# Altium project Digital_Menu.PrjPcb
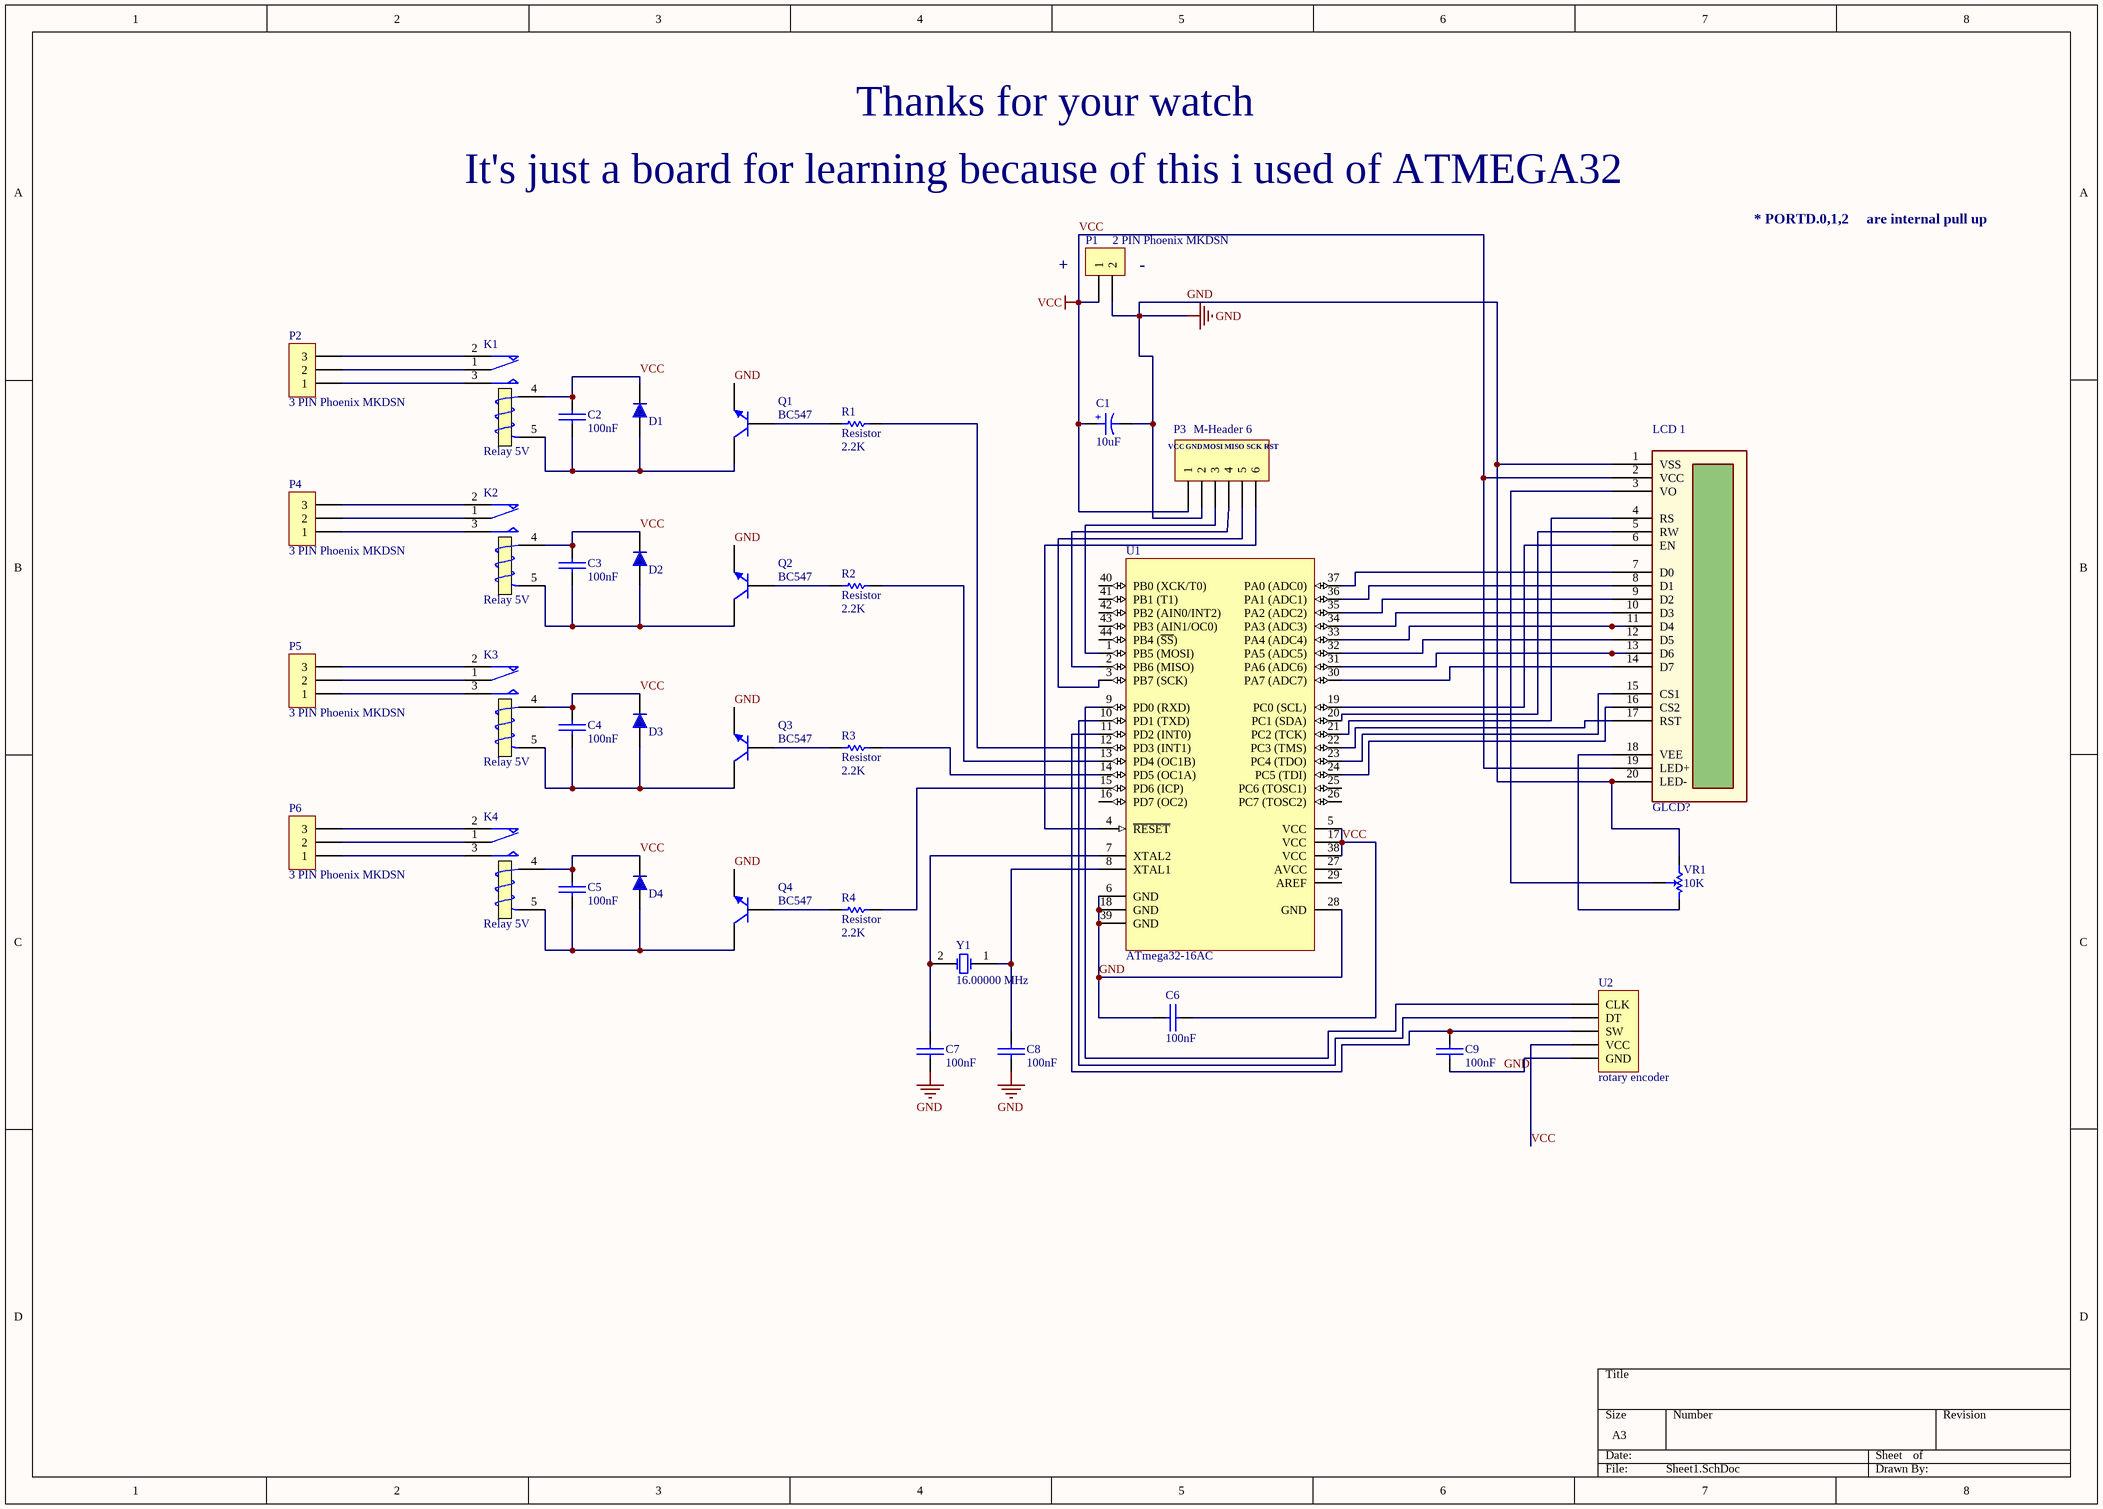
[diagram p0: Sheet1.SchDoc]
1 sheet, 36 parts. Net scope: global (net labels, ports and power ports of the same name join across sheets).
Board file: PCB1.PcbDoc

## Sheet Sheet1.SchDoc
size A3; SheetNumber: 1; SheetTotal: 1

### Parts
C1  10uF  [Cap 12.5x25-5]
C2  100nF  [Cap - 100nF]
C3  100nF  [Cap - 100nF]
C4  100nF  [Cap - 100nF]
C5  100nF  [Cap - 100nF]
C6  100nF  [Cap - 100nF]
C7  100nF  [Cap - 100nF]
C8  100nF  [Cap - 100nF]
C9  100nF  [Cap - 100nF]
D1  1n4007  [Diode 1N4007 SMD]  (value not drawn)
D2  1n4007  [Diode 1N4007 SMD]  (value not drawn)
D3  1n4007  [Diode 1N4007 SMD]  (value not drawn)
D4  1n4007  [Diode 1N4007 SMD]  (value not drawn)
K1  Relay 5V  [Relay 15.40x12.10x13.10]
K2  Relay 5V  [Relay 15.40x12.10x13.10]
K3  Relay 5V  [Relay 15.40x12.10x13.10]
K4  Relay 5V  [Relay 15.40x12.10x13.10]
LCD_1  GLCD?  [LCD 128x64 graphic]
P1  2 PIN Phoenix MKDSN  [2 PIN Phoenix MKDSN]
P2  3 PIN Phoenix MKDSN  [3 PIN Phoenix MKDSN]
P3  M-Header 6  [M-Header 6]
P4  3 PIN Phoenix MKDSN  [3 PIN Phoenix MKDSN]
P5  3 PIN Phoenix MKDSN  [3 PIN Phoenix MKDSN]
P6  3 PIN Phoenix MKDSN  [3 PIN Phoenix MKDSN]
Q1  BC547  [BC547 SMD SOT-23]
Q2  BC547  [BC547 SMD SOT-23]
Q3  BC547  [BC547 SMD SOT-23]
Q4  BC547  [BC547 SMD SOT-23]
R1  Resistor  value 2.2K  [Resistor_SMD_1206 (3216)]
R2  Resistor  value 2.2K  [Resistor_SMD_1206 (3216)]
R3  Resistor  value 2.2K  [Resistor_SMD_1206 (3216)]
R4  Resistor  value 2.2K  [Resistor_SMD_1206 (3216)]
U1  ATmega32-16AC  [44A]
U2  rotary encoder  [rotary encoder]
VR1  value 10K  [Multi Turn]  (hidden comment: Multi Turn)
Y1  16.00000 MHz  [XTAL Small]

### Nets
GND: C1.2 C6.1(+) C7.2(-) C8.2(-) C9.2(-) LCD_1.1(VSS) LCD_1.20(LED-) P1.2 P3.2 Q1.1(E) Q2.1(E) Q3.1(E) Q4.1(E) U1.6(GND) U1.18(GND) U1.28(GND) U1.39(GND) U2.5(GND) VR1.1(CCW)
VCC: C1.1 C2.2(-) C3.2(-) C4.2(-) C5.2(-) C6.2(-) D1.2 D2.2 D3.2 D4.2 K1.4(T1) K2.4(T1) K3.4(T1) K4.4(T1) LCD_1.2(VCC) LCD_1.19(LED+) P1.1 P3.1 U1.5(VCC) U1.17(VCC) U1.38(VCC) U2.4(VCC)
NetC2_1: C2.1(+) D1.1 K1.5(T2) Q1.3(C)
NetC3_1: C3.1(+) D2.1 K2.5(T2) Q2.3(C)
NetC4_1: C4.1(+) D3.1 K3.5(T2) Q3.3(C)
NetC5_1: C5.1(+) D4.1 K4.5(T2) Q4.3(C)
NetC7_1: C7.1(+) U1.7(XTAL2) Y1.2(OSC2)
NetC8_1: C8.1(+) U1.8(XTAL1) Y1.1(OSC1)
NetC9_1: C9.1(+) U1.11(PD2_(INT0)) U2.3(SW)
NetK1_1: K1.1(COM) P2.2
NetK1_2: K1.2(NC) P2.3
NetK1_3: K1.3(NO) P2.1
NetK2_1: K2.1(COM) P4.2
NetK2_2: K2.2(NC) P4.3
NetK2_3: K2.3(NO) P4.1
NetK3_1: K3.1(COM) P5.2
NetK3_2: K3.2(NC) P5.3
NetK3_3: K3.3(NO) P5.1
NetK4_1: K4.1(COM) P6.2
NetK4_2: K4.2(NC) P6.3
NetK4_3: K4.3(NO) P6.1
NetLCD_1_3: LCD_1.3(VO) VR1.3(Setpoint)
NetLCD_1_4: LCD_1.4(RS) U1.21(PC2_(TCK))
NetLCD_1_5: LCD_1.5(RW) U1.20(PC1_(SDA))
NetLCD_1_6: LCD_1.6(EN) U1.19(PC0_(SCL))
NetLCD_1_7: LCD_1.7(D0) U1.37(PA0_(ADC0))
NetLCD_1_8: LCD_1.8(D1) U1.36(PA1_(ADC1))
NetLCD_1_9: LCD_1.9(D2) U1.35(PA2_(ADC2))
NetLCD_1_10: LCD_1.10(D3) U1.34(PA3_(ADC3))
NetLCD_1_11: LCD_1.11(D4) U1.33(PA4_(ADC4))
NetLCD_1_12: LCD_1.12(D5) U1.32(PA5_(ADC5))
NetLCD_1_13: LCD_1.13(D6) U1.31(PA6_(ADC6))
NetLCD_1_14: LCD_1.14(D7) U1.30(PA7_(ADC7))
NetLCD_1_15: LCD_1.15(CS1) U1.23(PC4_(TDO))
NetLCD_1_16: LCD_1.16(CS2) U1.24(PC5_(TDI))
NetLCD_1_17: LCD_1.17(RST) U1.22(PC3_(TMS))
NetLCD_1_18: LCD_1.18(VEE) VR1.2(CW)
NetP3_3: P3.3 U1.1(PB5_(MOSI))
NetP3_4: P3.4 U1.2(PB6_(MISO))
NetP3_5: P3.5 U1.3(PB7_(SCK))
NetP3_6: P3.6 U1.4(~{RESET})
NetQ1_2: Q1.2(B) R1.1
NetQ2_2: Q2.2(B) R2.1
NetQ3_2: Q3.2(B) R3.1
NetQ4_2: Q4.2(B) R4.1
NetR1_2: R1.2 U1.12(PD3_(INT1))
NetR2_2: R2.2 U1.13(PD4_(OC1B))
NetR3_2: R3.2 U1.14(PD5_(OC1A))
NetR4_2: R4.2 U1.15(PD6_(ICP))
NetU1_9: U1.9(PD0_(RXD)) U2.1(CLK)
NetU1_10: U1.10(PD1_(TXD)) U2.2(DT)

Not connected (* = marked no-connect by the designer): U1 16(PD7_(OC2)) 25(PC6_(TOSC1)) 26(PC7_(TOSC2)) 27(AVCC) 29(AREF) 40(PB0_(XCK/T0)) 41(PB1_(T1)) 42(PB2_(AIN0/INT2)) 43(PB3_(AIN1/OC0)) 44(PB4_(~{SS}))

### Notes on the sheet
- Thanks for your watch
- It's just a board for learning because of this i used of ATMEGA32
- * PORTD.0,1,2     are internal pull up
- (near P1) +
- (near P1) -
- (near P3) VCC
- (near P3) GND
- (near P3) MOSI
- (near P3) MISO
- (near P3) SCK
- (near P3) RST
- (in symbol Capacitor DIP) +

### Library data of the parts
C1 = Capacitor DIP
C2-C9 = Cap-Bipolar: Bipolar Capacitor; Voltage: 100V; Designer: Saeid Jorablo; Organazation: ControTec; Adding Date: 1387/12/20; Value: 100nF
D1-D4 = Diode 1n4007
K1-K4 = Relay 15.40x12.10x13.10
LCD_1 = LCD 128x64 graphic
R1-R4 = Resistor: Email: razi.vesali@gmail.com; Published: 17-Jun-2016; LatestRevisionNote: Re-released for puplic; Publisher: Seyed Razi Vesali
U1 = ATmega32-16AC: 8-Bit AVR Microcontroller with 32K Bytes of In-System Programmable Flash Memory; Package Information: Latest Revision: 1995; Published: 17-Sep-2003; Revision: 17-Dec-2003: PCB Footprint updated; Datasheet: Latest Revision: 2503C-AVR-10/02; Package Reference: 44A; Publisher: Altium Limited
VR1 = Multi Turn: Email: Razi.vesali@gmail.com; LatestRevisionDate: 17-Jul-2016; LatestRevisionNote: Re-released for Puplic; Publisher: Seyed Razi vesali (SRV)
Y1 = XTAL: XTAL Crystal; Company: E.P.I.L; Design Date: 11/04/2011; Value: 16.00000 MHz